# EAGLE design Pool Controller-v3 (EAGLE 9.6.2)
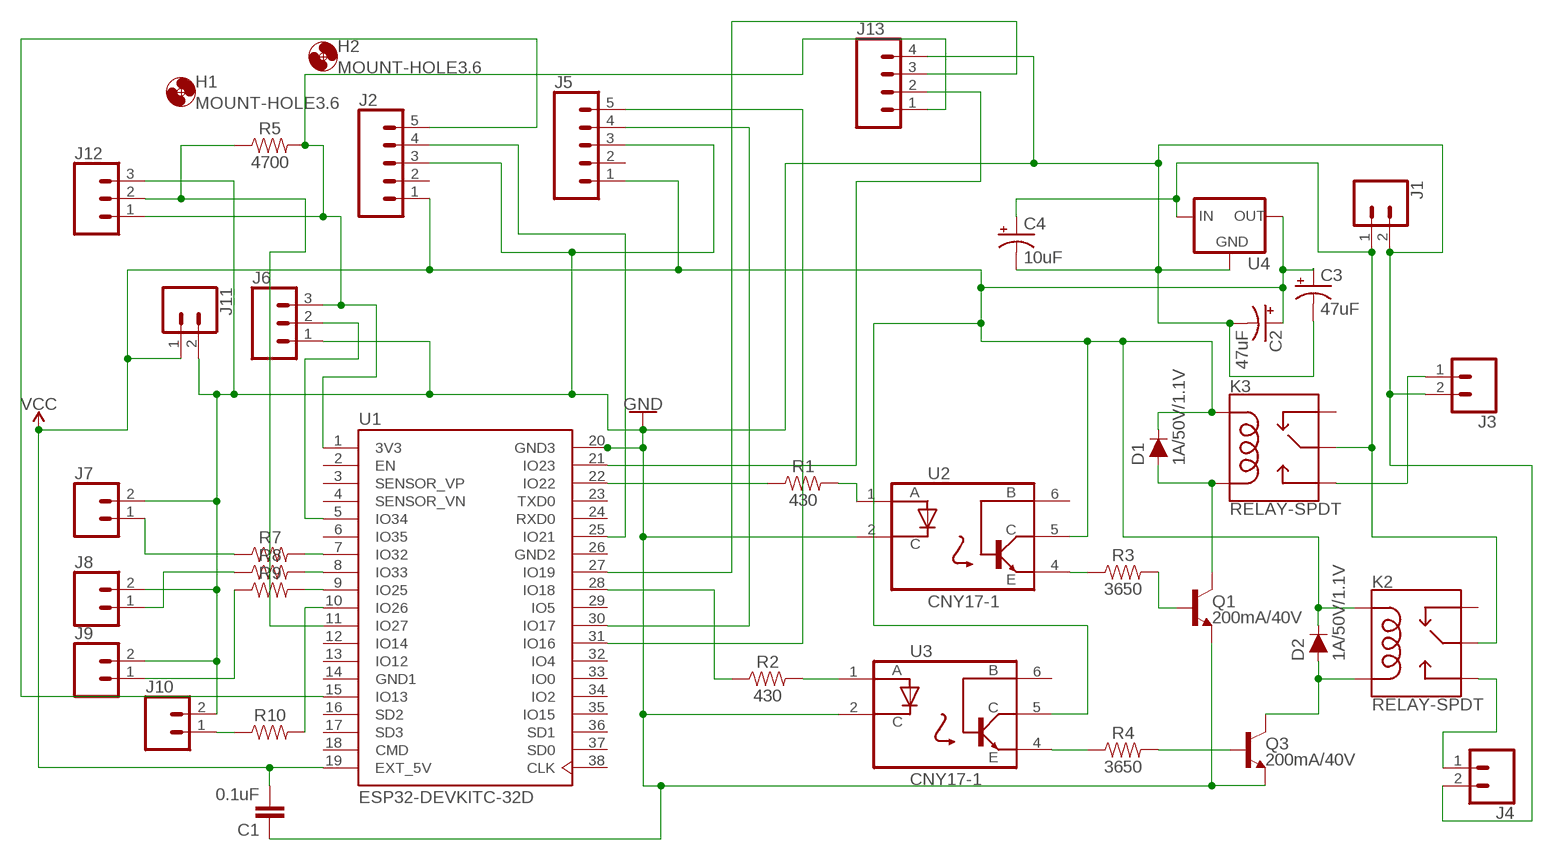
[diagram p0: schematic, sheet 1]

## Parts
C1  0.1uF  0.1UF-KIT-EZ-50V-20%  [CAP-PTH-SMALL-KIT]
C2  47uF  10UF-POLAR-RADIAL-2.5MM-KIT-25V-20%  [CPOL-RADIAL-2.5MM-5MM-KIT]
C3  47uF  10UF-POLAR-RADIAL-2.5MM-25V-20%  [CPOL-RADIAL-2.5MM-5MM]
C4  10uF  10UF-POLAR-RADIAL-2.5MM-25V-20%  [CPOL-RADIAL-2.5MM-5MM]
D1  1A/50V/1.1V  DIODE-PTH  [DIODE-1N4001]
D2  1A/50V/1.1V  DIODE-PTH  [DIODE-1N4001]
H1  MOUNT-HOLE3.6  [3,6]
H2  MOUNT-HOLE3.6  [3,6]
J1  CONN_023.5MM  [SCREWTERMINAL-3.5MM-2]
J2  CONN_05  [1X05]
J3  CONN_023.5MM  [SCREWTERMINAL-3.5MM-2]
J4  CONN_023.5MM  [SCREWTERMINAL-3.5MM-2]
J5  CONN_05  [1X05]
J6  CONN_03SCREW  [SCREWTERMINAL-3.5MM-3]
J7  CONN_02  [1X02]
J8  CONN_02  [1X02]
J9  CONN_02  [1X02]
J10  CONN_02  [1X02]
J11  CONN_023.5MM  [SCREWTERMINAL-3.5MM-2]
J12  CONN_03SCREW  [SCREWTERMINAL-3.5MM-3]
J13  CONN_04SCREW  [SCREWTERMINAL-3.5MM-4]
K2  RELAY-SPDT  [RELAY_G5LE]
K3  RELAY-SPDT  [RELAY_G5LE]
Q1  200mA/40V  TRANS_NPN-2N3904  [TO-92]
Q3  200mA/40V  TRANS_NPN-2N3904  [TO-92]
R1  430  RESISTORAXIAL-0.3  [AXIAL-0.3]
R2  430  RESISTORAXIAL-0.3  [AXIAL-0.3]
R3  3650  RESISTORAXIAL-0.3  [AXIAL-0.3]
R4  3650  RESISTORAXIAL-0.3  [AXIAL-0.3]
R5  4700  RESISTORAXIAL-0.3  [AXIAL-0.3]
R7  RESISTORAXIAL-0.3  [AXIAL-0.3]
R8  RESISTORAXIAL-0.3  [AXIAL-0.3]
R9  RESISTORAXIAL-0.3  [AXIAL-0.3]
R10  RESISTORAXIAL-0.3  [AXIAL-0.3]
U1  ESP32-DEVKITC-32D  [MODULE_ESP32-DEVKITC-32D]
U2  CNY17-1  [DIP762W50P254L730H410Q6]
U3  CNY17-1  [DIP762W50P254L730H410Q6]
U4  V_REG_78XXSIDE  [78XXL]

## Nets
GND [Power]: C1.1 C2.2(-) C3.2(-) C4.2(-) J1.2 J2.3 J3.2 J4.2 J5.3 J6.1 J7.2 J8.2 J9.2 J10.2 J11.2 J12.3 J13.4 Q1.1(E) Q3.1(E) U1.20(GND3) U2.2(C) U3.2(C) U4.GND
N$1: R2.P$2 U3.1(A)
N$2: R1.P$1 U1.22(IO22)
N$3: R1.P$2 U2.1(A)
N$4: R2.P$1 U1.28(IO18)
N$5: R3.P$1 U2.4(E)
N$6: Q1.2(B) R3.P$2
N$7: D1.A K3.5(COIL2) Q1.3(C)
N$8 [Power]: C4.1(+) J1.1 K2.1(MAIN) K3.1(MAIN) U4.IN
N$9: J5.4 U1.30(IO17)
N$10 [Power]: J3.1 K3.3(NO)
N$11: J6.3 J12.1 J13.1 R5.P$2 U1.1(3V3)
N$12: D2.A K2.5(COIL2) Q3.3(C)
N$13 [Power]: J4.1 K2.3(NO)
N$14: R4.P$1 U3.4(E)
N$15: Q3.2(B) R4.P$2
N$16: J6.2 U1.5(IO34)
N$17: J2.5 U1.15(IO13)
N$18: J2.4 U1.25(IO21)
N$19: J5.5 U1.31(IO16)
N$20: J12.2 R5.P$1 U1.11(IO27)
N$21: R7.P$2 U1.7(IO32)
N$22: J7.1 R7.P$1
N$23: R8.P$2 U1.8(IO33)
N$24: J8.1 R8.P$1
N$25: R9.P$2 U1.9(IO25)
N$26: J9.1 R9.P$1
N$27: J10.1 R10.P$1
N$28: R10.P$2 U1.10(IO26)
N$29: J13.3 U1.27(IO19)
N$30: J13.2 U1.21(IO23)
VCC [Power]: C1.2 C2.1(+) C3.1(+) D1.C D2.C J2.1 J5.1 J11.1 K2.2(COIL1) K3.2(COIL1) U1.19(EXT_5V) U2.5(C`) U3.5(C`) U4.OUT
Unconnected: J2.2 J5.2 K2.4(NC) K3.4(NC) U1.2(EN) U1.3(SENSOR_VP) U1.4(SENSOR_VN) U1.6(IO35) U1.12(IO14) U1.13(IO12) U1.16(SD2) U1.17(SD3) U1.18(CMD) U1.23(TXD0) U1.24(RXD0) U1.29(IO5) U1.32(IO4) U1.33(IO0) U1.34(IO2) U1.35(IO15) U1.36(SD1) U1.37(SD0) U1.38(CLK) U2.6(B) U3.6(B)

## Power pins joined to a net without a drawn wire
GND1: U1.14(GND1)
GND2: U1.26(GND2)

## Library data of the parts
C1 = SparkFun-Capacitors:0.1UF: 0.1µF ceramic capacitors A capacitor is a passive two-terminal electrical component used to store electrical energy temporarily in an electric field.; PROD_ID: CAP-08370
C2 C3 = SparkFun-Capacitors:10UF-POLAR: 10.0µF polarized capacitors A capacitor is a passive two-terminal electrical component used to store electrical energy temporarily in an electric field.; PROD_ID: CAP-08440; VALUE: 10uF
C4 = SparkFun-Capacitors:10UF-POLAR: 10.0µF polarized capacitors A capacitor is a passive two-terminal electrical component used to store electrical energy temporarily in an electric field.; PROD_ID: CAP-08440
D1 D2 = SparkFun-DiscreteSemi:DIODE: Diode These are standard reverse protection diodes and small signal diodes. SparkFun Products: SparkFun SparkPunk Sound Kit <https://www.sparkfun.com/products/11177> SparkFun ESP8266 Thing <https://www.sparkfun.com/products/13231>; PROD_ID: DIO-09176
H1 H2 = holes:MOUNT-HOLE: MOUNTING HOLE with drill center marker
J1 J3 J4 J11 = SparkFun-Connectors:CONN_02: Multi connection point. Often used as Generic Header-pin footprint for 0.1 inch spaced/style header connections On any of the 0.1 inch spaced packages, you can populate with these: Break Away Headers - Straight <https://www.sparkfun.com/products/116> (PRT-00116) Break Away Male Headers - Right Angle <https://www.sparkfun.com/products/553> (PRT-00553) Female Headers <https://www.sparkfun.com/products/115> (PRT-00115) Break Away Headers - Machine Pin <https://www.sparkfun.com/products/117> (PRT-00117) Break Away Female Headers - Swiss Machine Pin <https://www.sparkfun.com/products/743> (PRT-00743) For SCREWTERMINALS and SPRING TERMINALS visit here: Screw Terimnals on SparkFun.com <https://www.sparkfun.com/search/results?term=Screw+Terminals> (5mm/3.5mm/2.54mm spacing) This device is also useful as a general connection point to wire up your design to another part of your project. Our various solder wires solder well into these plated through hole pads. Hook-Up Wire - Assortment (Stranded, 22 AWG) <https://www.sparkfun.com/products/11375> (PRT-11375) Hook-Up Wire - Assortment (Solid Core, 22 AWG) <https://www.sparkfun.com/products/11367> (PRT-11367) View the entire wire category on our website here <https://www.sparkfun.com/categories/141> Special notes: Molex polarized connector foot print use with: PRT-08233 with associated crimp pins and housings. 2.54_SCREWTERM for use with PRT-10571. 3.5mm Screw Terminal footprints for PRT-08084 5mm Screw Terminal footprints for use with PRT-08432; PROD_ID: CONN-08399
J2 J5 = SparkFun-Connectors:CONN_05: Multi connection point. Often used as Generic Header-pin footprint for 0.1 inch spaced/style header connections On any of the 0.1 inch spaced packages, you can populate with these: Break Away Headers - Straight <https://www.sparkfun.com/products/116> (PRT-00116) Break Away Male Headers - Right Angle <https://www.sparkfun.com/products/553> (PRT-00553) Female Headers <https://www.sparkfun.com/products/115> (PRT-00115) Break Away Headers - Machine Pin <https://www.sparkfun.com/products/117> (PRT-00117) Break Away Female Headers - Swiss Machine Pin <https://www.sparkfun.com/products/743> (PRT-00743) For SCREWTERMINALS and SPRING TERMINALS visit here: Screw Terimnals on SparkFun.com <https://www.sparkfun.com/search/results?term=Screw+Terminals> (5mm/3.5mm/2.54mm spacing) This device is also useful as a general connection point to wire up your design to another part of your project. Our various solder wires solder well into these plated through hole pads. Hook-Up Wire - Assortment (Stranded, 22 AWG) <https://www.sparkfun.com/products/11375> (PRT-11375) Hook-Up Wire - Assortment (Solid Core, 22 AWG) <https://www.sparkfun.com/products/11367> (PRT-11367) View the entire wire category on our website here <https://www.sparkfun.com/categories/141> Special notes: Molex polarized connector foot print use with SKU : PRT-08231 with associated crimp pins and housings. 1MM SMD Version SKU: PRT-10208
J6 J12 = SparkFun-Connectors:CONN_03: Multi connection point. Often used as Generic Header-pin footprint for 0.1 inch spaced/style header connections On any of the 0.1 inch spaced packages, you can populate with these: Break Away Headers - Straight <https://www.sparkfun.com/products/116> (PRT-00116) Break Away Male Headers - Right Angle <https://www.sparkfun.com/products/553> (PRT-00553) Female Headers <https://www.sparkfun.com/products/115> (PRT-00115) Break Away Headers - Machine Pin <https://www.sparkfun.com/products/117> (PRT-00117) Break Away Female Headers - Swiss Machine Pin <https://www.sparkfun.com/products/743> (PRT-00743) Stackable Header - 3 Pin (Female, 0.1") <https://www.sparkfun.com/products/13875> (PRT-13875) For SCREWTERMINALS and SPRING TERMINALS visit here: Screw Terimnals on SparkFun.com <https://www.sparkfun.com/search/results?term=Screw+Terminals> (5mm/3.5mm/2.54mm spacing) This device is also useful as a general connection point to wire up your design to another part of your project. Our various solder wires solder well into these plated through hole pads. Hook-Up Wire - Assortment (Stranded, 22 AWG) <https://www.sparkfun.com/products/11375> (PRT-11375) Hook-Up Wire - Assortment (Solid Core, 22 AWG) <https://www.sparkfun.com/products/11367> (PRT-11367) View the entire wire category on our website here <https://www.sparkfun.com/categories/141> Special notes: Molex polarized connector foot print use with SKU : PRT-08232 with associated crimp pins and housings.; PROD_ID: CONN-08288; SF_ID: PRT-08235
J7-J10 = SparkFun-Connectors:CONN_02: Multi connection point. Often used as Generic Header-pin footprint for 0.1 inch spaced/style header connections On any of the 0.1 inch spaced packages, you can populate with these: Break Away Headers - Straight <https://www.sparkfun.com/products/116> (PRT-00116) Break Away Male Headers - Right Angle <https://www.sparkfun.com/products/553> (PRT-00553) Female Headers <https://www.sparkfun.com/products/115> (PRT-00115) Break Away Headers - Machine Pin <https://www.sparkfun.com/products/117> (PRT-00117) Break Away Female Headers - Swiss Machine Pin <https://www.sparkfun.com/products/743> (PRT-00743) For SCREWTERMINALS and SPRING TERMINALS visit here: Screw Terimnals on SparkFun.com <https://www.sparkfun.com/search/results?term=Screw+Terminals> (5mm/3.5mm/2.54mm spacing) This device is also useful as a general connection point to wire up your design to another part of your project. Our various solder wires solder well into these plated through hole pads. Hook-Up Wire - Assortment (Stranded, 22 AWG) <https://www.sparkfun.com/products/11375> (PRT-11375) Hook-Up Wire - Assortment (Solid Core, 22 AWG) <https://www.sparkfun.com/products/11367> (PRT-11367) View the entire wire category on our website here <https://www.sparkfun.com/categories/141> Special notes: Molex polarized connector foot print use with: PRT-08233 with associated crimp pins and housings. 2.54_SCREWTERM for use with PRT-10571. 3.5mm Screw Terminal footprints for PRT-08084 5mm Screw Terminal footprints for use with PRT-08432
J13 = SparkFun-Connectors:CONN_04: Multi connection point. Often used as Generic Header-pin footprint for 0.1 inch spaced/style header connections On any of the 0.1 inch spaced packages, you can populate with these: Break Away Headers - Straight <https://www.sparkfun.com/products/116> (PRT-00116) Break Away Male Headers - Right Angle <https://www.sparkfun.com/products/553> (PRT-00553) Female Headers <https://www.sparkfun.com/products/115> (PRT-00115) Break Away Headers - Machine Pin <https://www.sparkfun.com/products/117> (PRT-00117) Break Away Female Headers - Swiss Machine Pin <https://www.sparkfun.com/products/743> (PRT-00743) For SCREWTERMINALS and SPRING TERMINALS visit here: Screw Terimnals on SparkFun.com <https://www.sparkfun.com/search/results?term=Screw+Terminals> (5mm/3.5mm/2.54mm spacing) This device is also useful as a general connection point to wire up your design to another part of your project. Our various solder wires solder well into these plated through hole pads. Hook-Up Wire - Assortment (Stranded, 22 AWG) <https://www.sparkfun.com/products/11375> (PRT-11375) Hook-Up Wire - Assortment (Solid Core, 22 AWG) <https://www.sparkfun.com/products/11367> (PRT-11367) View the entire wire category on our website here <https://www.sparkfun.com/categories/141> Special notes: Molex polarized connector foot print use with SKU : PRT-08231 with associated crimp pins and housings. 1MM SMD Version SKU: PRT-10208; PROD_ID: 2xCONN-08399; SF_ID: 2xPRT-08084
K2 K3 = SparkFun-Electromechanical:RELAY-SPDT: SPDT Electromechanical Relay Single-pole, double-throw sealed relays. When current is applied to the coil, it throws a simple changeover switch, terminating the connection from the NC contact to ground and closing the NO contact. Use them to switch high voltage/high current devices. SparkFun Products JQX-15F: Relay SPDT Sealed - 20A <https://www.sparkfun.com/products/10924> (COM-10924) JZC-11F: Relay SPDT Sealed <https://www.sparkfun.com/products/100> (COM-00100); PROD_ID: COMP-14214
Q1 Q3 = SparkFun-DiscreteSemi:TRANS_NPN: NPN transistor Current controlled devices typically used to amplify current or used as a switch. BC547 - COM-08928 <http://www.sparkfun.com/products/8928> (TO-92 45V 100mA) (1.Collector 2.Base 3.Emitter) 2N3904 - COM-00521 <http://www.sparkfun.com/products/521> (TO-92 40V 200mA) (1.Emitter 2.Base 3.Collector) P2N2222A - COM-12852 <http://www.sparkfun.com/products/12852> (TO-92 40V 600mA) (1.Collector 2.Base 3.Emitter); PROD_ID: TRANS-08447
R1-R5 R7-R10 = SparkFun-Resistors:RESISTOR: Generic Resistor Package
U1 = HiLetgo ESP32:ESP32-DEVKITC-32D: Eval Board For Esp-Wroom-32; AVAILABILITY: Unavailable; DESCRIPTION: - Transceiver; 802.11 b/g/n _Wi-Fi, WiFi, WLAN_, Bluetooth® Smart Ready 4.x Dual Mode For Use With ESP-WROOM-32; MF: Espressif Systems; MP: ESP32-DEVKITC-32D; PACKAGE: None; PRICE: None
U2 U3 = CNY17-1:CNY17-1; AVAILABILITY: Unavailable; DESCRIPTION: Optoisolator Transistor with Base Output 5000Vrms 1 Channel 6-DIP; MF: Vishay; MP: CNY17-1; PACKAGE: DIP-6 Vishay; PRICE: None
U4 = SparkFun-IC-Power:V_REG_78XX: Voltage Regulator Standard 78xx regulator. IGO (Input Ground Output). Spark Fun Electronics SKU : COM-00107

## Net classes
0 default: width 0.254 mm, clearance 0.152 mm
1 Power: width 1.905 mm, clearance 0.152 mm

## Board
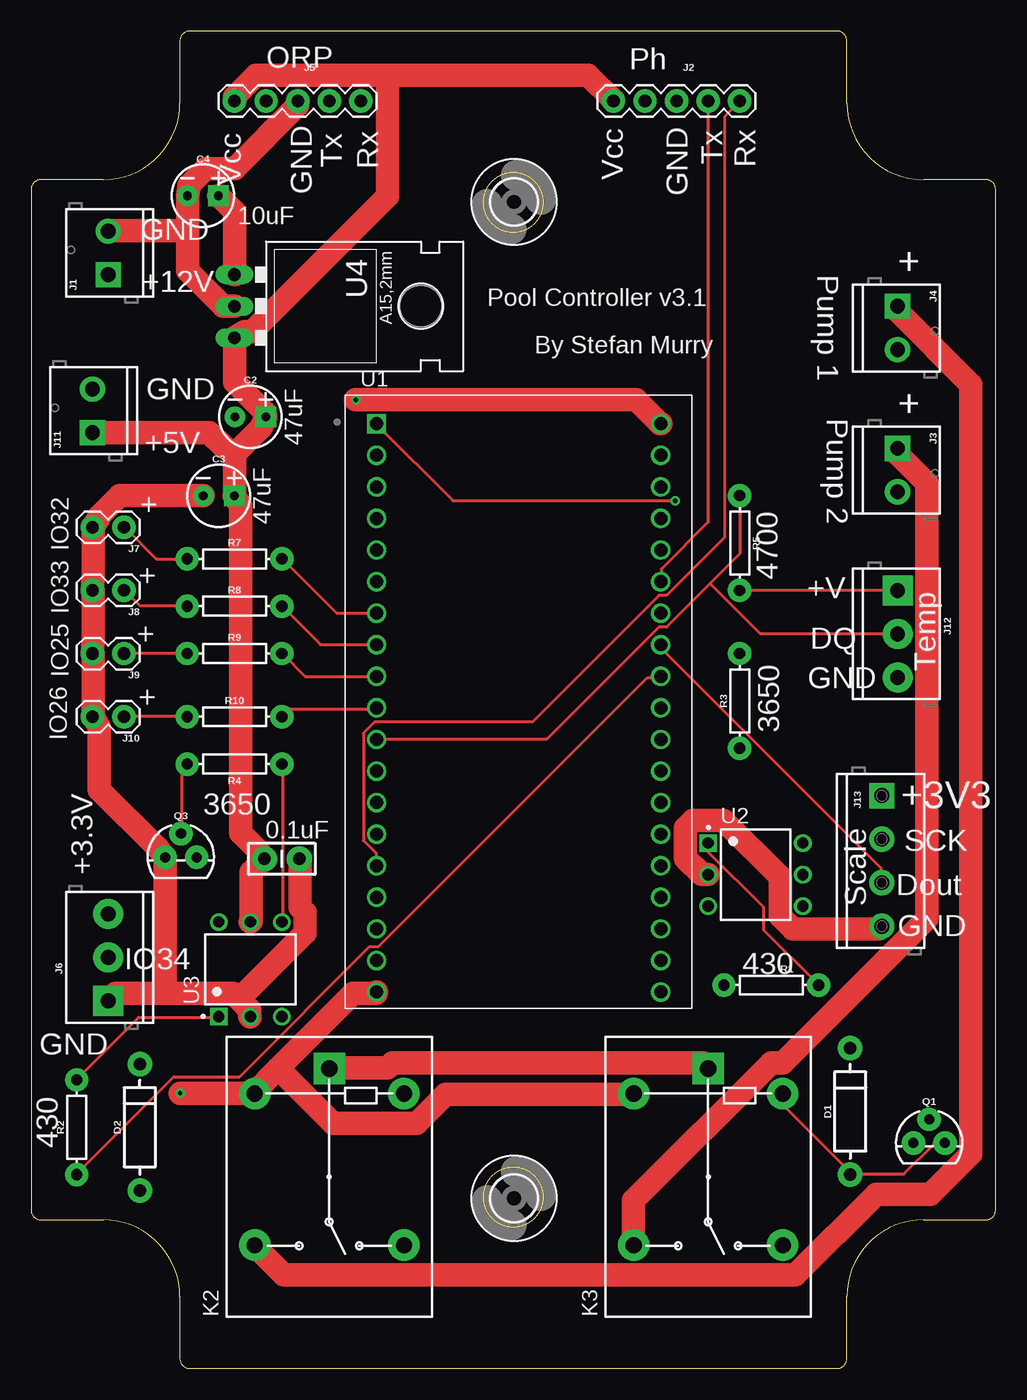
[diagram p1: board, top side]
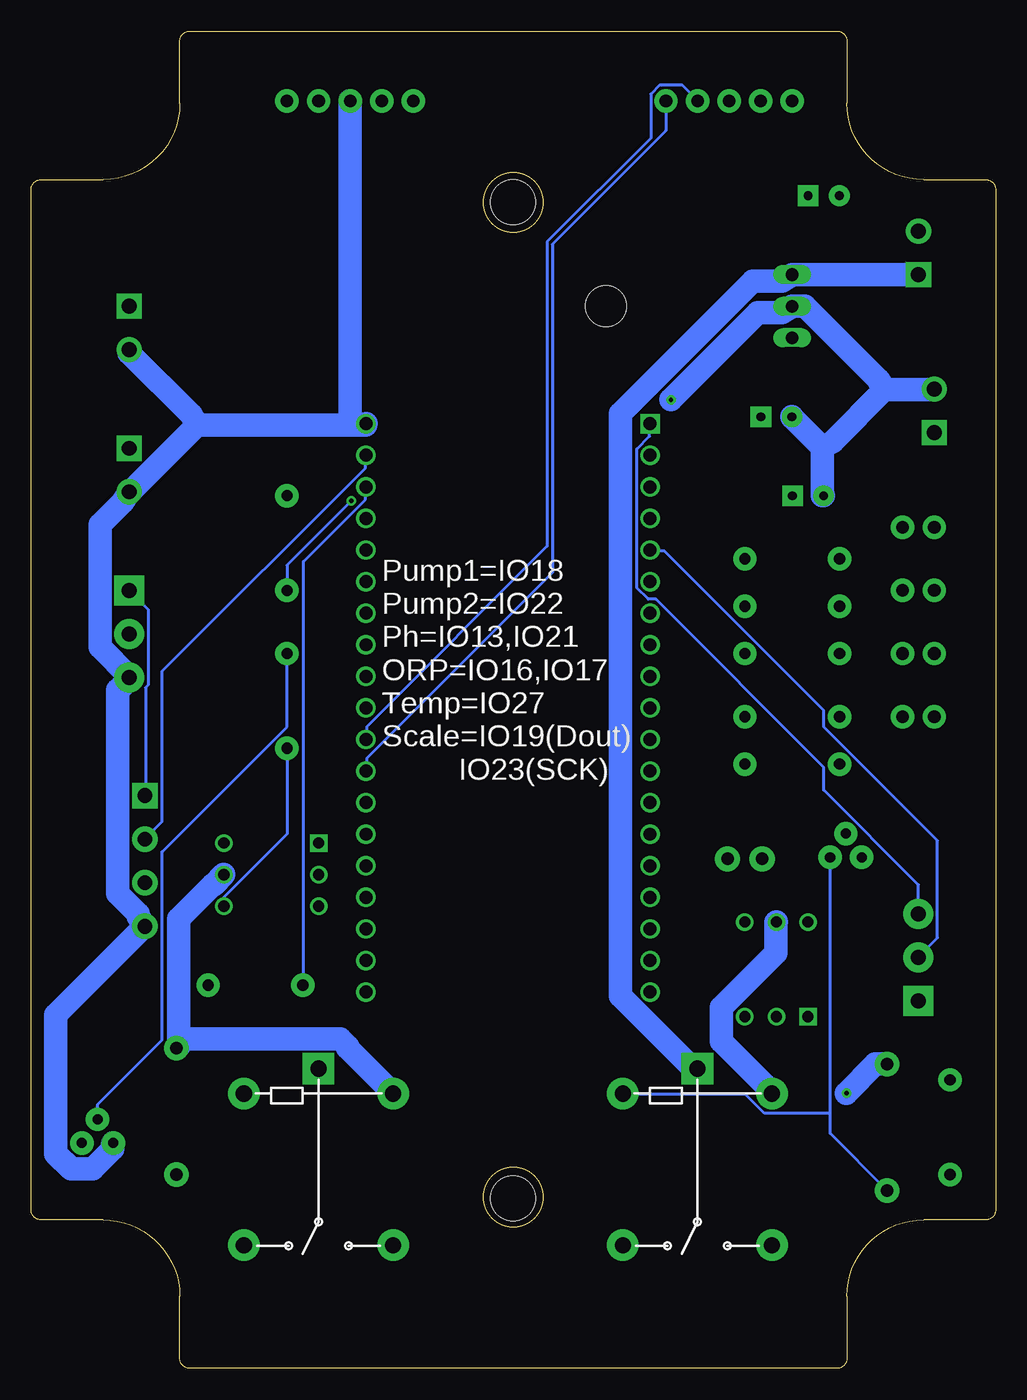
[diagram p2: board, bottom side, seen from below]

Size 77.6 x 107.57 mm. Coordinates in mm from the lower left corner, seen from the top.
Outline: 0.79,95.62 arc90 0,94.82 0,12.75 arc90 0.79,11.95 5.8,11.95 arc-90 11.97,5.79 11.97,0.79 arc90 12.76,0 64.84,0 arc90 65.63,0.79 65.63,5.79 arc-90 71.8,11.95 76.8,11.95 arc90 77.6,12.75 77.6,94.82 arc90 76.8,95.62 71.8,95.62 arc-90 65.63,101.79 65.63,106.78 arc90 64.84,107.57 12.76,107.57 arc90 11.97,106.78 11.97,101.79 arc-90 5.8,95.62 0.79,95.62
Outline: circle at 38.8,93.79 radius 2.37
Outline: circle at 38.8,13.79 radius 2.37
Copper layers (1*16): Top 0.035mm / dielectric 1.5mm / Bottom 0.035mm
Design rules "default": minimum track width 6mil, minimum drill 0.35mm, track to track 6mil, track to pad 6mil, pad to pad 6mil, via to via 6mil, smd to smd 6mil, copper to edge 40mil, drill to drill 6mil, minimum pad ring 10mil, minimum via ring 8mil, stop-mask expansion 4mil, vias tented up to drill 0mil, thermal gap 10mil

### Footprints (pad centres in the part's own frame; a part is rotated, then mirrored left to right if it is on the bottom)
CAP-PTH-SMALL-KIT = drill 1.016 pad 2.032: 1 -1.397,0; 2 1.397,0
CPOL-RADIAL-2.5MM-5MM-KIT = drill 0.7 pad 1.651 square: 1 1.25,0 | drill 0.7 pad 1.651: 2 -1.25,0
CPOL-RADIAL-2.5MM-5MM = drill 0.7 pad 1.651 square: 1 1.25,0 | drill 0.7 pad 1.651: 2 -1.25,0
DIODE-1N4001 = drill 1 pad 1.981: A -5.08,0; C 5.08,0
3,6 = hole 3.6: 0,0
SCREWTERMINAL-3.5MM-2 = drill 1.2 pad 2.032 square: 1 0,0 | drill 1.2 pad 2.032: 2 3.5,0
1X05 = drill 1.016 pad 1.88: 1 0,0; 2 2.54,0; 3 5.08,0; 4 7.62,0; 5 10.16,0
SCREWTERMINAL-3.5MM-3 = drill 1.2 pad 2.413 square: 1 0,0 | drill 1.2 pad 2.413: 2 3.5,0; 3 7,0
1X02 = drill 1.016 pad 1.88: 1 0,0; 2 2.54,0
SCREWTERMINAL-3.5MM-4 = drill 1.2 pad 2.032 square: 1 0,0 | drill 1.2 pad 2.032: 2 3.5,0; 3 7,0; 4 10.5,0
RELAY_G5LE = drill 1.3 pad 2.54 square: 1 8.52,-0.005 | drill 1.3 pad 2.54: 2 6.52,5.995; 3 -5.68,5.995; 4 -5.68,-6.005; 5 6.52,-6.005
TO-92 = drill 0.813 pad 1.88: 1 -1.27,0; 2 0,1.905; 3 1.27,0
AXIAL-0.3 = drill 0.9 pad 1.88: P$1 -3.81,0; P$2 3.81,0
MODULE_ESP32-DEVKITC-32D = drill 1.04 square: 1 -11.43,19.76 | drill 1.04: 2 -11.43,17.22; 3 -11.43,14.68; 4 -11.43,12.14; 5 -11.43,9.6; 6 -11.43,7.06; 7 -11.43,4.52; 8 -11.43,1.98; 9 -11.43,-0.56; 10 -11.43,-3.1; 11 -11.43,-5.64; 12 -11.43,-8.18; 13 -11.43,-10.72; 14 -11.43,-13.26; 15 -11.43,-15.8; 16 -11.43,-18.34; 17 -11.43,-20.88; 18 -11.43,-23.42; 19 -11.43,-25.96; 20 11.43,19.76; 21 11.43,17.22; 22 11.43,14.68; 23 11.43,12.14; 24 11.43,9.6; 25 11.43,7.06; 26 11.43,4.52; 27 11.43,1.98; 28 11.43,-0.56; 29 11.43,-3.1; 30 11.43,-5.64; 31 11.43,-8.18; 32 11.43,-10.72; 33 11.43,-13.26; 34 11.43,-15.8; 35 11.43,-18.34; 36 11.43,-20.88; 37 11.43,-23.42; 38 11.43,-25.96
DIP762W50P254L730H410Q6 = drill 0.9 pad 1.4 square: 1 -3.81,2.54 | drill 0.9 pad 1.4: 2 -3.81,0; 3 -3.81,-2.54; 4 3.81,-2.54; 5 3.81,0; 6 3.81,2.54
78XXL = drill 1.016 long: GND 0,-3.81; IN -2.54,-3.81; OUT 2.54,-3.81 | hole 3.302: 0,11.176

### Placement (x,y rotation side)
C1  20.18,40.99 180 top
C2  17.64,76.55 0 top
C3  15.1,70.2 0 top
C4  13.83,94.33 0 top
D1  65.9,20.67 90 top
D2  8.75,19.4 90 top
H1  38.85,13.68 0 top
H2  38.85,93.82 0 top
J1  6.21,87.98 90 top
J2  46.85,101.95 0 top
J3  69.71,74.01 270 top
J4  69.71,85.44 270 top
J5  16.37,101.95 0 top
J6  6.21,29.56 90 top
J7  7.48,67.66 180 top
J8  7.48,62.58 180 top
J9  7.48,57.5 180 top
J10  7.48,52.42 180 top
J11  4.94,75.28 90 top
J12  69.71,62.58 270 top
J13  68.44,46.07 270 top
K2  23.99,15.59 90 top
K3  54.47,15.59 90 top
Q1  72.25,18.13 0 top
Q3  12.05,41.12 0 top
R1  59.55,30.83 0 top
R2  3.67,19.4 90 top
R3  57.01,53.69 90 top
R4  16.37,48.61 180 top
R5  57.01,66.39 270 top
R7  16.37,65.12 0 top
R8  16.37,61.31 0 top
R9  16.37,57.5 0 top
R10  16.37,52.42 0 top
U1  39.23,56.23 0 top
U2  58.28,39.72 0 top
U3  17.64,32.1 90 top
U4  20.18,85.44 270 top

### Tracks (layer width: path | path; a pad name or v marks a point on that pad's centre or on a via)
GND  (via drill 0.35)
  Top 1.905: U4.GND 15.45,85.44 12.61,88.28 12.61,91.54 | 12.61,94.28 12.61,91.54 | 12.61,94.28 C4.2 | J5.3 21.45,101.59 16.37,96.51 14.03,96.51 12.71,95.19 12.61,94.28 | 12.61,91.54 6.21,91.54 J1.2 | 16.72,29.71 16.27,30.17 10.78,30.17 | 16.72,29.71 17.59,28.85 17.59,28.34 U3.2 | 10.78,30.17 6.82,30.17 J6.1 | 10.78,30.17 Q3.1 10.17,41.85 5.5,46.53 5.5,51.61 4.99,52.42 | 16.72,29.71 22.06,35.05 22.06,36.67 21.65,37.08 21.65,40.94 C1.1 | 4.99,52.42 4.99,57.5 J9.2 4.99,58.41 4.99,62.58 J8.2 4.99,63.49 4.99,67.66 | 4.99,52.42 J10.2 | 4.99,67.66 J7.2 | C3.2 7.12,70.2 5.5,68.57 5.5,68.47 4.99,67.66 | U2.2 53.96,39.72 52.64,41.04 52.64,43.48 53.25,44.09 55.69,44.09 60.26,39.52 60.26,36.37 61.27,35.35 68.18,35.35 68.39,35.55 J13.4 | v26.12,77.92 48.68,77.92 50.61,75.99 U1.20
  Bottom 1.905: 13.93,74.06 13.93,70.2 C3.2 | 13.93,74.06 16.37,76.5 C2.2 | 8.95,78.73 4.99,78.73 J11.2 | 8.95,78.73 13.12,74.57 13.93,74.06 | 8.95,78.73 9.46,79.55 15.35,85.44 U4.GND 17.18,84.93 19.11,84.93 v26.12,77.92 | Q1.1 71.03,18.08 71.03,17.67 72.65,16.05 74.38,16.05 75.6,17.27 75.6,28.44 68.49,35.55 J13.4 69,36.37 69,36.57 70.62,38.2 70.62,54.55 70.32,54.86 J12.3 69.71,55.67 72.04,58.01 72.04,67.86 70.22,69.69 J3.2 69.71,70.61 69.5,70.61 64.22,75.89 | 64.22,75.89 51.93,75.89 | 51.93,75.89 50.71,75.89 U1.20 | 51.93,75.89 J2.3 | J4.2 69.71,81.68 64.73,76.7 64.22,75.89
N$1
  Top 0.254: U3.1 15.05,28.24 8.65,28.24 3.67,23.26 R2.P$2
N$2
  Bottom 0.254: U1.22 50.71,70.81 50.71,69.89 55.69,64.92 55.69,30.88 R1.P$1
N$3
  Top 0.254: U2.1 54.47,41.55 58.94,37.08 58.94,35.25 R1.P$2
N$4
  Top 0.254: U1.28 50.61,55.57 49.59,55.57 27.95,33.93 27.24,33.93 16.77,23.46 11.49,23.46 3.67,15.64 R2.P$1
N$5
  Bottom 0.254: U2.4 62.09,37.89 57.01,42.97 R3.P$1
N$6
  Bottom 0.254: R3.P$2 57.01,51.61 67.07,41.55 67.07,26.41 72.25,21.23 Q1.2
N$7
  Top 0.254: Q1.3 73.47,18.08 72.65,18.08 70.22,15.64 65.95,15.64 D1.A 65.95,15.74 60.56,21.13 60.56,22.04 K3.5
N$8
  Top 1.905: U4.IN 16.37,93.06 15.15,94.28 C4.1 | K2.1 24.09,24.17 28.66,24.17 29.07,24.58 54.06,24.58 54.47,24.17 K3.1
  Bottom 1.905: J1.1 U4.IN 17.18,87.47 19.52,87.47 30.19,76.8 30.19,29.97 24.39,24.17 24.09,24.17 K2.1
N$9
  Bottom 0.254: U1.30 50.61,50.59 50.61,51.61 36.08,66.14 36.08,90.62 27.75,98.95 27.75,102.51 27.04,103.22 25.21,103.22 23.99,102 J5.4
N$10
  Top 1.905: J3.1 69.71,73.55 72.04,71.22 72.04,36.16 60.46,24.58 59.55,24.58 48.47,13.51 48.47,9.95 K3.3
N$11  (via drill 0.35)
  Top 0.254: J12.1 R5.P$2 | v51.83,69.79 33.94,69.79 27.85,75.89 U1.1
  Bottom 0.254: J12.1 68.18,61.06 68.18,54.96 68.39,54.76 68.39,46.12 J13.1 | J6.3 6.21,38.91 13.83,46.53 13.83,48.36 27.34,61.87 27.95,61.87 28.86,62.78 28.86,73.96 27.85,74.97 27.85,75.89 U1.1 | R5.P$2 57.01,64.61 v51.83,69.79
N$12
  Bottom 0.254: 13.32,20.52 13.32,18.89 D2.A | 13.32,20.52 Q3.3 | 13.32,20.52 18.6,20.52 20.13,22.04 29.98,22.04 K2.5
N$13
  Top 1.905: J4.1 69.71,85.03 75.6,79.14 75.6,17.27 72.35,14.01 67.98,14.01 61.48,7.51 20.33,7.51 17.99,9.85 K2.3
N$14
  Top 0.254: U3.4 20.23,35.96 20.23,48.56 R4.P$1
N$15
  Top 0.254: R4.P$2 12.1,48.15 12.1,43.07 Q3.2
N$16
  Bottom 0.254: U1.5 27.75,65.73 26.63,65.73 13.83,52.93 13.83,51.61 4.68,42.46 4.68,34.64 6.21,33.12 J6.2
N$17
  Top 0.254: U1.15 27.75,40.43 27.75,41.45 26.73,42.46 26.73,51.1 27.65,52.01 40.35,52.01 50.51,62.17 51.11,62.17 55.79,66.85 55.79,100.68 57.01,101.9 J2.5
N$18
  Top 0.254: J2.4 54.47,68.07 50.71,64.31 50.71,63.29 U1.25
N$19
  Bottom 0.254: J5.5 26.53,99.56 35.67,90.42 35.67,64 50.61,49.07 50.61,48.05 U1.31
N$20
  Top 0.254: 54.62,63.14 57.01,65.53 R5.P$1 | 54.62,63.14 51.11,59.63 50.51,59.63 41.46,50.59 27.85,50.59 U1.11 | 54.62,63.14 58.63,59.13 69.71,59.13 J12.2
N$21
  Top 0.254: U1.7 27.75,60.75 24.6,60.75 20.23,65.12 R7.P$2
N$22
  Top 0.254: R7.P$1 10.07,65.12 7.53,67.66 J7.1
N$23
  Top 0.254: R8.P$2 23.28,58.21 27.75,58.21 U1.8
N$24
  Top 0.254: R8.P$1 12.51,61.36 8.75,61.36 7.53,62.58 J8.1
N$25
  Top 0.254: U1.9 27.75,55.67 22.06,55.67 20.23,57.5 R9.P$2
N$26
  Top 0.254: R9.P$1 J9.1
N$27
  Top 0.254: R10.P$1 J10.1
N$28
  Top 0.254: U1.10 27.75,53.03 20.84,53.03 20.23,52.42 R10.P$2
N$29
  Top 0.254: U1.27 50.71,58.11 50.71,57.91 68.39,40.23 68.39,39.11 J13.3
N$30
  Bottom 0.254: U1.21 50.71,73.35 50.71,72.43 67.07,56.08 67.07,43.99 68.39,42.67 J13.2
VCC  (via drill 0.35)
  Top 1.905: 16.37,73.55 16.37,70.2 C3.1 16.88,69.39 16.88,43.07 18.2,41.75 C1.2 18.7,40.94 17.69,39.92 17.69,35.96 U3.5 | 16.37,73.55 18.5,75.69 C2.1 18.81,76.6 18.81,76.91 16.37,79.34 U4.OUT 17.18,83.41 17.79,83.41 28.66,94.28 28.66,104.03 | J11.1 14.34,75.28 15.55,74.06 16.37,73.55 | J5.1 16.37,102.31 18.09,104.03 28.66,104.03 | 28.66,104.03 44.82,104.03 46.85,102 J2.1 | 19.87,24.12 17.89,22.14 K2.2 16.98,22.14 v12,22.14 | 19.87,24.12 25.92,30.17 27.75,30.17 U1.19 | 19.87,24.12 24.29,19.7 31,19.7 33.33,22.04 48.37,22.04 K3.2
  Bottom 1.905: U2.5 62.9,38.91 63,38.91 65.75,36.16 65.75,26.51 | 65.75,26.51 65.75,25.9 D1.C | 65.75,26.51 52.74,26.51 52.13,25.9 52.13,25.8 48.47,22.14 K3.2 | D2.C 9.66,24.48 v12,22.14 | U3.5 17.69,35.86 17.69,33.42 22.06,29.05 22.06,26.31 17.89,22.14 K2.2

### Text on the board
tPlace: ORP | Ph | Tx | Tx | Rx | Rx | Vcc | Vcc | GND | GND | 10uF | GND | +12V | Pump 1 | + | Pool Controller v3.1 | By Stefan Murry | GND | Pump 2 | + | +5V | 47uF | + | 4700 | 47uF | IO32 | +V | + | IO33 | DQ | + | IO25 | Temp | GND | + | 3650 | IO26 | +3V3 | 3650 | 0.1uF | SCK | +3.3V | Dout | Scale | GND | 430 | IO34 | GND | 430
bPlace: Pump1=IO18 / Pump2=IO22 / Ph=IO13,IO21 / ORP=IO16,IO17 / Temp=IO27 / Scale=IO19(Dout) / IO23(SCK)